# EAGLE design vss_adapter (EAGLE 7.7.0)
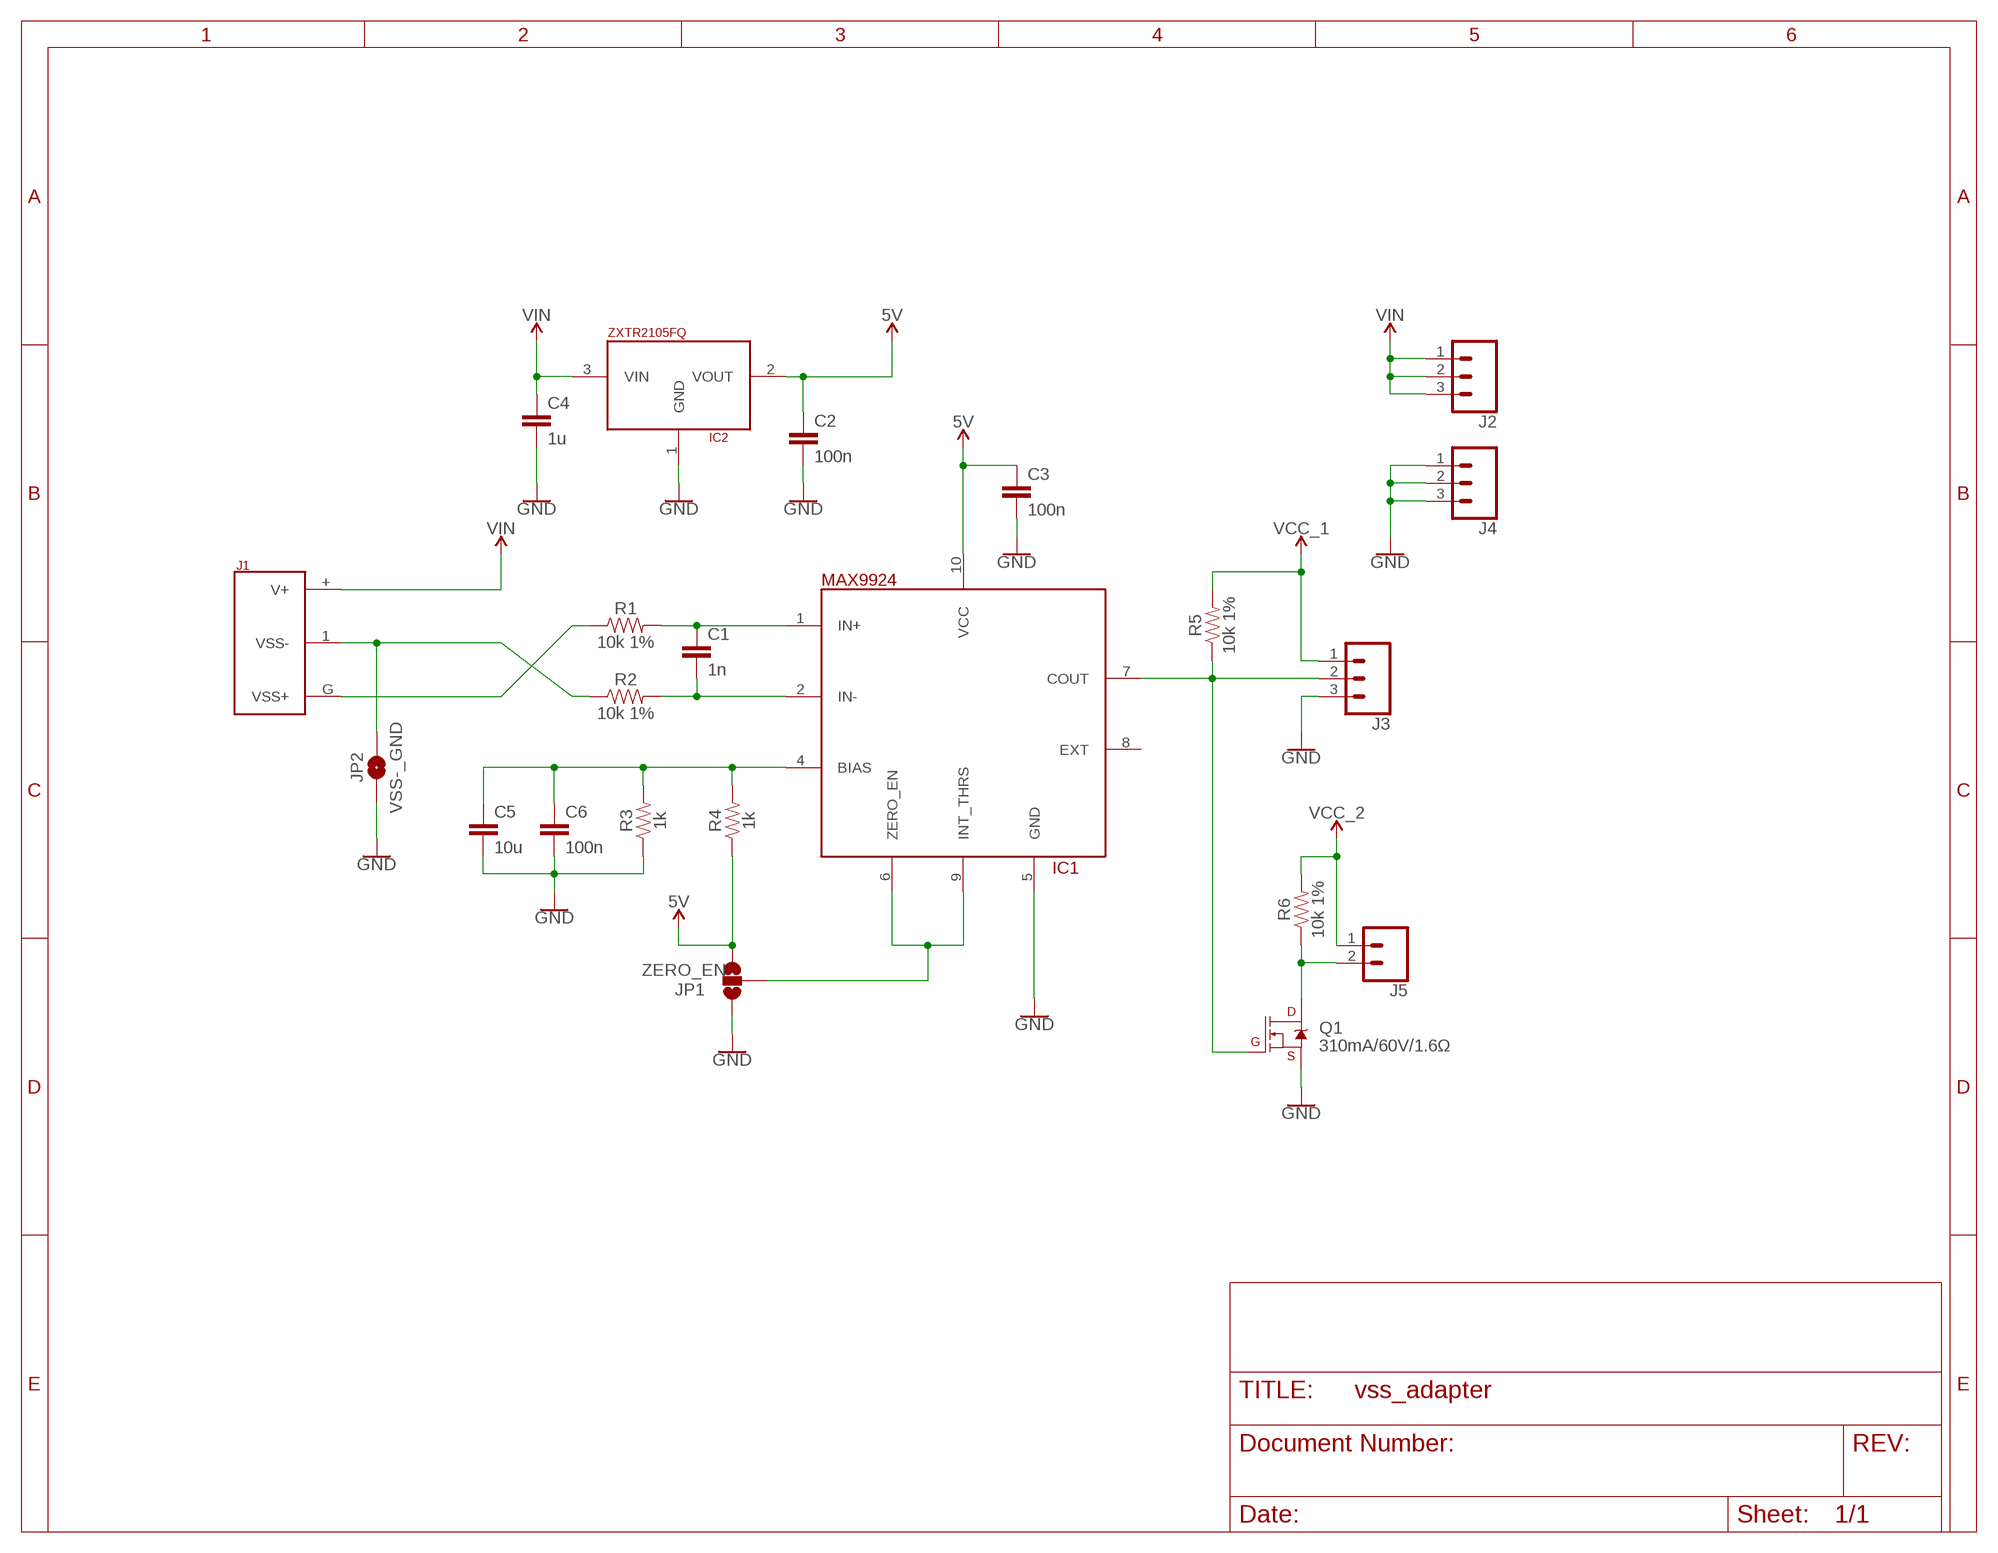
[diagram p0: schematic, sheet 1]

## Parts
C1  1n  CL10B102KB8NNWC  [0603]
C2  100n  CL10B104MB8NNNC  [0603]
C3  100n  CL10B104MB8NNNC  [0603]
C4  1u  CL10A105KA8NNNC  [0603]
C5  10u  CL10B106MQ8NRNC  [0603]
C6  100n  CL10B104MB8NNNC  [0603]
IC1  MAX9924  [UMAX10]
IC2  ZXTR2105FQ  [SOT23]
J1  VOLVO_CONN_VSS  [VOLVO_CONN_VSS]
J2  CONN_031X03_LARGE  [1X03_LARGE]
J3  CONN_031X03_LARGE  [1X03_LARGE]
J4  CONN_031X03_LARGE  [1X03_LARGE]
J5  CONN_02LARGE  [1X02_LARGE]
JP1  ZERO_EN  JUMPER-SMT_3_NO_SILK  [SMT-JUMPER_3_NO_SILK]
JP2  VSS-_GND  JUMPER-SMT_2_NO_SILK  [SMT-JUMPER_2_NO_SILK]
Q1  310mA/60V/1.6Ω  MOSFET-NCH-2N7002PW  [SOT323]
R1  10k 1%  RC0603FR-1010KL  [0603]
R2  10k 1%  RC0603FR-1010KL  [0603]
R3  1k  RC0603JR-071KL  [0603]
R4  1k  RC0603JR-071KL  [0603]
R5  10k 1%  RC0603FR-1010KL  [0603]
R6  10k 1%  RC0603FR-1010KL  [0603]

## Nets
5V: C2.1 C3.1 IC1.10(VCC) IC2.2(VOUT) JP1.3 R4.1
GND: C2.2 C3.2 C4.2 C5.2 C6.2 IC1.5(GND) IC2.1(GND) J3.3 J4.1 J4.2 J4.3 JP1.1 JP2.1 Q1.2(S) R3.1
IN+: C1.1 IC1.1(IN+) R1.2
IN-: C1.2 IC1.2(IN-) R2.2
N$5: C5.1 C6.1 IC1.4(BIAS) R3.2 R4.2
N$6: IC1.6(ZERO_EN) IC1.9(INT_THRS) JP1.2
VCC_1: J3.1 R5.2
VCC_2: J5.1 R6.2
VIN: C4.1 IC2.3(VIN) J1.+(V+) J2.1 J2.2 J2.3
VSS2_OUT: J5.2 Q1.3(D) R6.1
VSS+: J1.G(VSS+) R1.1
VSS-: J1.1(VSS-) JP2.2 R2.1
VSS_OUT: IC1.7(COUT) J3.2 Q1.1(G) R5.1
Unconnected: IC1.8(EXT)

## Library data of the parts
C1-C6 = digital_dash:CL
IC1 = digital_dash:MAX9924
IC2 = digital_dash:ZXTR2105
J1 = digital_dash:VOLVO_CONN_VSS
J2-J4 = digital_dash:CONN_03: Multi connection point. Often used as Generic Header-pin footprint for 0.1 inch spaced/style header connections On any of the 0.1 inch spaced packages, you can populate with these: Break Away Headers - Straight <https://www.sparkfun.com/products/116> (PRT-00116) Break Away Male Headers - Right Angle <https://www.sparkfun.com/products/553> (PRT-00553) Female Headers <https://www.sparkfun.com/products/115> (PRT-00115) Break Away Headers - Machine Pin <https://www.sparkfun.com/products/117> (PRT-00117) Break Away Female Headers - Swiss Machine Pin <https://www.sparkfun.com/products/743> (PRT-00743) Stackable Header - 3 Pin (Female, 0.1") <https://www.sparkfun.com/products/13875> (PRT-13875) For SCREWTERMINALS and SPRING TERMINALS visit here: Screw Terimnals on SparkFun.com <https://www.sparkfun.com/search/results?term=Screw+Terminals> (5mm/3.5mm/2.54mm spacing) This device is also useful as a general connection point to wire up your design to another part of your project. Our various solder wires solder well into these plated through hole pads. Hook-Up Wire - Assortment (Stranded, 22 AWG) <https://www.sparkfun.com/products/11375> (PRT-11375) Hook-Up Wire - Assortment (Solid Core, 22 AWG) <https://www.sparkfun.com/products/11367> (PRT-11367) View the entire wire category on our website here <https://www.sparkfun.com/categories/141> Special notes: Molex polarized connector foot print use with SKU : PRT-08232 with associated crimp pins and housings.
J5 = digital_dash:CONN_02: Multi connection point. Often used as Generic Header-pin footprint for 0.1 inch spaced/style header connections On any of the 0.1 inch spaced packages, you can populate with these: Break Away Headers - Straight <https://www.sparkfun.com/products/116> (PRT-00116) Break Away Male Headers - Right Angle <https://www.sparkfun.com/products/553> (PRT-00553) Female Headers <https://www.sparkfun.com/products/115> (PRT-00115) Break Away Headers - Machine Pin <https://www.sparkfun.com/products/117> (PRT-00117) Break Away Female Headers - Swiss Machine Pin <https://www.sparkfun.com/products/743> (PRT-00743) For SCREWTERMINALS and SPRING TERMINALS visit here: Screw Terimnals on SparkFun.com <https://www.sparkfun.com/search/results?term=Screw+Terminals> (5mm/3.5mm/2.54mm spacing) This device is also useful as a general connection point to wire up your design to another part of your project. Our various solder wires solder well into these plated through hole pads. Hook-Up Wire - Assortment (Stranded, 22 AWG) <https://www.sparkfun.com/products/11375> (PRT-11375) Hook-Up Wire - Assortment (Solid Core, 22 AWG) <https://www.sparkfun.com/products/11367> (PRT-11367) View the entire wire category on our website here <https://www.sparkfun.com/categories/141> Special notes: Molex polarized connector foot print use with: PRT-08233 with associated crimp pins and housings. 2.54_SCREWTERM for use with PRT-10571. 3.5mm Screw Terminal footprints for PRT-08084 5mm Screw Terminal footprints for use with PRT-08432
JP1 = SparkFun-Jumpers:JUMPER-SMT_3_NO: Normally open jumper This jumper has three pads in close proximity to each other. Apply solder to close the connection(s).
JP2 = SparkFun-Jumpers:JUMPER-SMT_2_NO: Normally open jumper This jumper has two pads in close proximity to each other. Apply solder to close the connection. Round pads are easier to solder for beginners, but are a lot larger. SparkFun Product that uses the round pads: SparkFun EL Sequencer <https://www.sparkfun.com/products/12781>
Q1 = SparkFun-DiscreteSemi:MOSFET-NCH: N-channel MOSFETs Voltage controlled devices that allow control of high current outputs. SparkFun Products: SparkFun OpenScale <https://www.sparkfun.com/products/13261> SparkFun Digital Sandbox <https://www.sparkfun.com/products/12651> SparkFun Monster Moto Shield <https://www.sparkfun.com/products/10182> SparkFun MOSFET Power Controller <https://www.sparkfun.com/products/11214>; PROD_ID: TRANS-11151
R1 R2 R5 R6 = digital_dash:RC0603FR
R3 R4 = digital_dash:RC0603JR

## Board
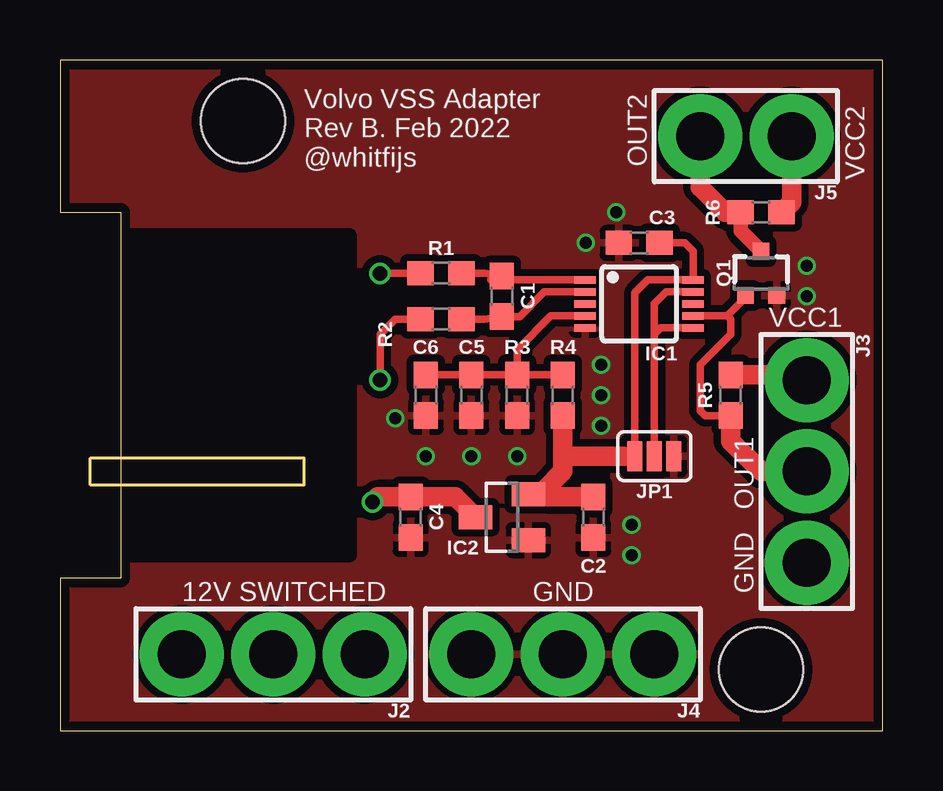
[diagram p1: board, top side]
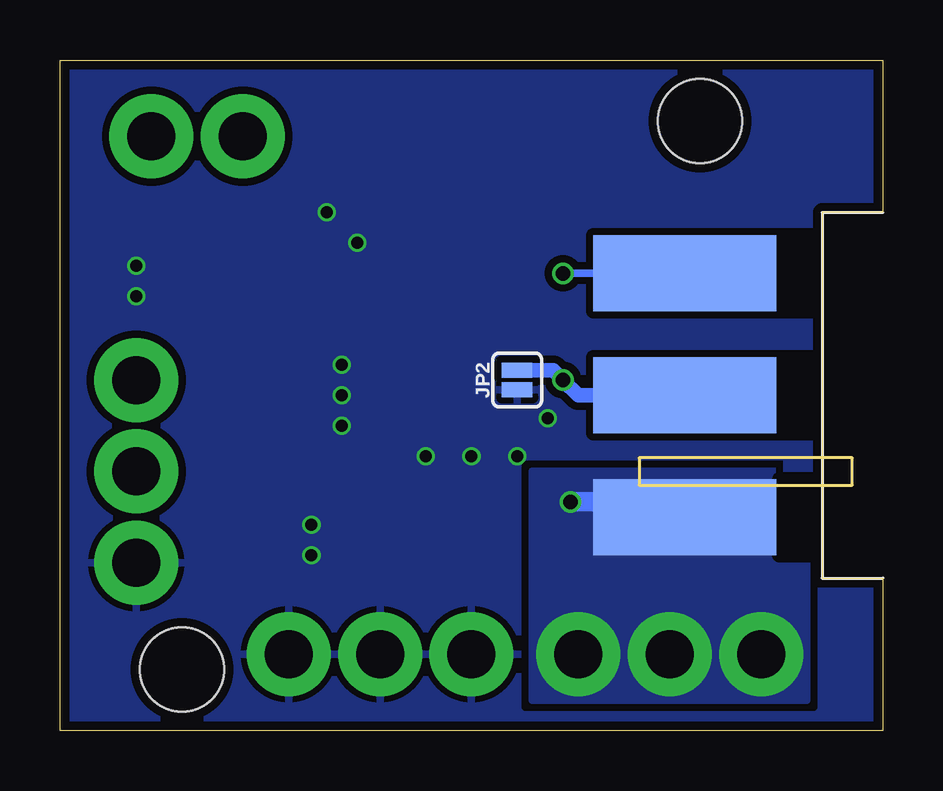
[diagram p2: board, bottom side, seen from below]

Size 34.29 x 27.94 mm. Coordinates in mm from the lower left corner, seen from the top.
Outline: 0,0 34.29,0 34.29,27.94 0,27.94 0,21.59 2.54,21.59 2.54,6.35 0,6.35 0,0
Copper layers (1*16): Top 0.035559375mm / dielectric 1.6mm / Bottom 0.035559375mm
Design rules "oshpark-2layer": minimum track width 6mil, minimum drill 10mil, track to track 6mil, track to pad 6mil, pad to pad 6mil, via to via 6mil, smd to smd 6mil, copper to edge 15mil, drill to drill 6mil, minimum pad ring 5mil, minimum via ring 5mil, stop-mask expansion 2.5mil, vias tented up to drill 0mil, thermal gap 10mil
Holes 3.5 mm at 29.21,2.54 7.62,25.4

### Footprints (pad centres in the part's own frame; a part is rotated, then mirrored left to right if it is on the bottom)
0603 = smd 1.1 x 1: 1 -0.85,0; 2 0.85,0
UMAX10 = smd 0.9 x 0.32: 1 -2.25,1; 2 -2.25,0.5; 3 -2.25,0; 4 -2.25,-0.5; 5 -2.25,-1; 6 2.25,-1; 7 2.25,-0.5; 8 2.25,0; 9 2.25,0.5; 10 2.25,1
SOT23 = smd 1 x 1.4: 1 -0.95,-1.1; 2 0.95,-1.1; 3 0,1.1
VOLVO_CONN_VSS = smd 7.62 x 3.175: 1 -5.715,0; + -5.715,-5.08; G -5.715,5.08
1X03_LARGE = drill 2 pad 3.5: 1 -3.81,0; 2 0,0; 3 3.81,0
1X02_LARGE = drill 2 pad 3.5: 1 -2.54,0; 2 1.27,0
SMT-JUMPER_3_NO_SILK = smd 0.635 x 1.27: 1 -0.813,0; 2 0,0; 3 0.813,0
SMT-JUMPER_2_NO_SILK = smd 0.635 x 1.27: 1 -0.406,0; 2 0.406,0
SOT323 = smd 0.7 x 0.7: 1 -0.65,-0.925; 2 0.65,-0.925; 3 0,0.925

### Placement (x,y rotation side)
C1  18.41,18.1 270 top
C2  22.23,8.89 270 top
C3  24.13,20.32 180 top
C4  14.61,8.89 270 top
C5  17.14,13.97 270 top
C6  15.24,13.97 270 top
IC1  24.13,17.78 0 top
IC2  18.41,8.89 90 top
J1  2.54,13.97 0 bottom
J2  8.89,3.17 180 top
J3  31.11,10.79 270 top
J4  20.95,3.17 180 top
J5  27.94,24.77 180 top
JP1  24.77,11.43 180 top
JP2  15.24,14.61 90 bottom
Q1  29.21,19.05 0 top
R1  15.88,19.05 0 top
R2  15.88,17.14 0 top
R3  19.05,13.97 90 top
R4  20.95,13.97 90 top
R5  27.94,13.97 90 top
R6  29.21,21.59 0 top

### Tracks (layer width: path | path; a pad name or v marks a point on that pad's centre or on a via)
5V
  Top 0.305: C3.1 26.04,20.32 26.38,19.98 IC1.10 24.5,18.78 23.95,18.24 JP1.3
  Top 0.61: JP1.3 23.5,11.43
  Top 0.813: IC2.2 20.23,9.93 | 20.23,9.93 20.36,9.74 C2.1 | R4.1 20.95,11.43 | 20.95,11.43 20.95,10.79 20.23,10.07 20.23,9.93 | 23.5,11.43 20.95,11.43
GND  (via drill 0.5)
  other vias: 22.54,15.24 22.54,13.97 22.54,12.7 15.24,11.43 17.14,11.43 19.05,11.43 21.91,20.32 23.18,21.59 13.97,13.02 23.81,7.3 23.81,8.57 31.11,18.1 31.11,19.37
  pour Top (isolate 0.305, rank 3): 0,27.94 34.29,27.94 34.29,0 0,0
  pour Bottom (isolate 0.305, rank 2): 0,28.57 34.29,28.57 34.29,0 0,0
IN+
  Top 0.305: R1.2 17.68,19.05 C1.1 | 17.95,18.78 C1.1 | C1.1 18.58,18.78 IC1.1
IN-
  Top 0.305: R2.2 17.68,17.14 C1.2 19.15,17.25 20.18,18.28 IC1.2
N$5
  Top 0.305: R3.2 C5.1 C6.1 | R3.2 R4.2 | IC1.4 20.45,17.28 19.05,15.88 R3.2
N$6
  Top 0.305: IC1.9 25.27,18.28 24.77,17.78 24.77,16.51 | 24.77,16.51 JP1.2 | IC1.6 25.04,16.78 24.77,16.51
VCC_1
  Top 0.813: R5.2 30.9,14.82 arc-90 J3.1
VCC_2
  Top 0.813: R6.2 30.48,22.01 J5.1
VIN  (via drill 0.6)
  Top 0.813: v13.02,9.53 13.23,9.74 C4.1 16.46,9.74 IC2.3
  Bottom 0.813: v13.02,9.53 8.89,9.53 J1.+
  pour Bottom (isolate 0.305, no thermals): 3.17,1.27 3.17,10.79 14.61,10.79 14.61,1.27
VSS2_OUT
  Top 0.61: Q1.3 28.36,20.82 R6.1
  Top 0.813: J5.2 26.67,22.64 27.73,21.59 R6.1
VSS+  (via drill 0.6)
  Top 0.305: v13.34,19.05 R1.1
  Bottom 0.305: J1.G v13.34,19.05
VSS-  (via drill 0.6)
  Top 0.305: v13.34,14.61 13.34,16.51 13.97,17.14 R2.1
  Bottom 0.61: J1.1 12.7,13.97 v13.34,14.61 13.74,15.01 JP2.2
VSS_OUT
  Top 0.305: IC1.7 27.8,17.28 | 27.8,17.28 27.94,17.14 27.94,16.51 26.67,15.24 26.67,13.34 26.89,13.12 R5.1 | 27.8,17.28 28.56,18.04 Q1.1
  Top 0.813: R5.1 27.94,12.06 29.21,10.79 J3.2

### Text on the board
tPlace: VCC2 | Volvo VSS Adapter / Rev B. Feb 2022 / @whitfijs | OUT2 | VCC1 | OUT1 | GND | 12V SWITCHED | GND